# Altium schematic sheet 01_MCU.SchDoc
size A3
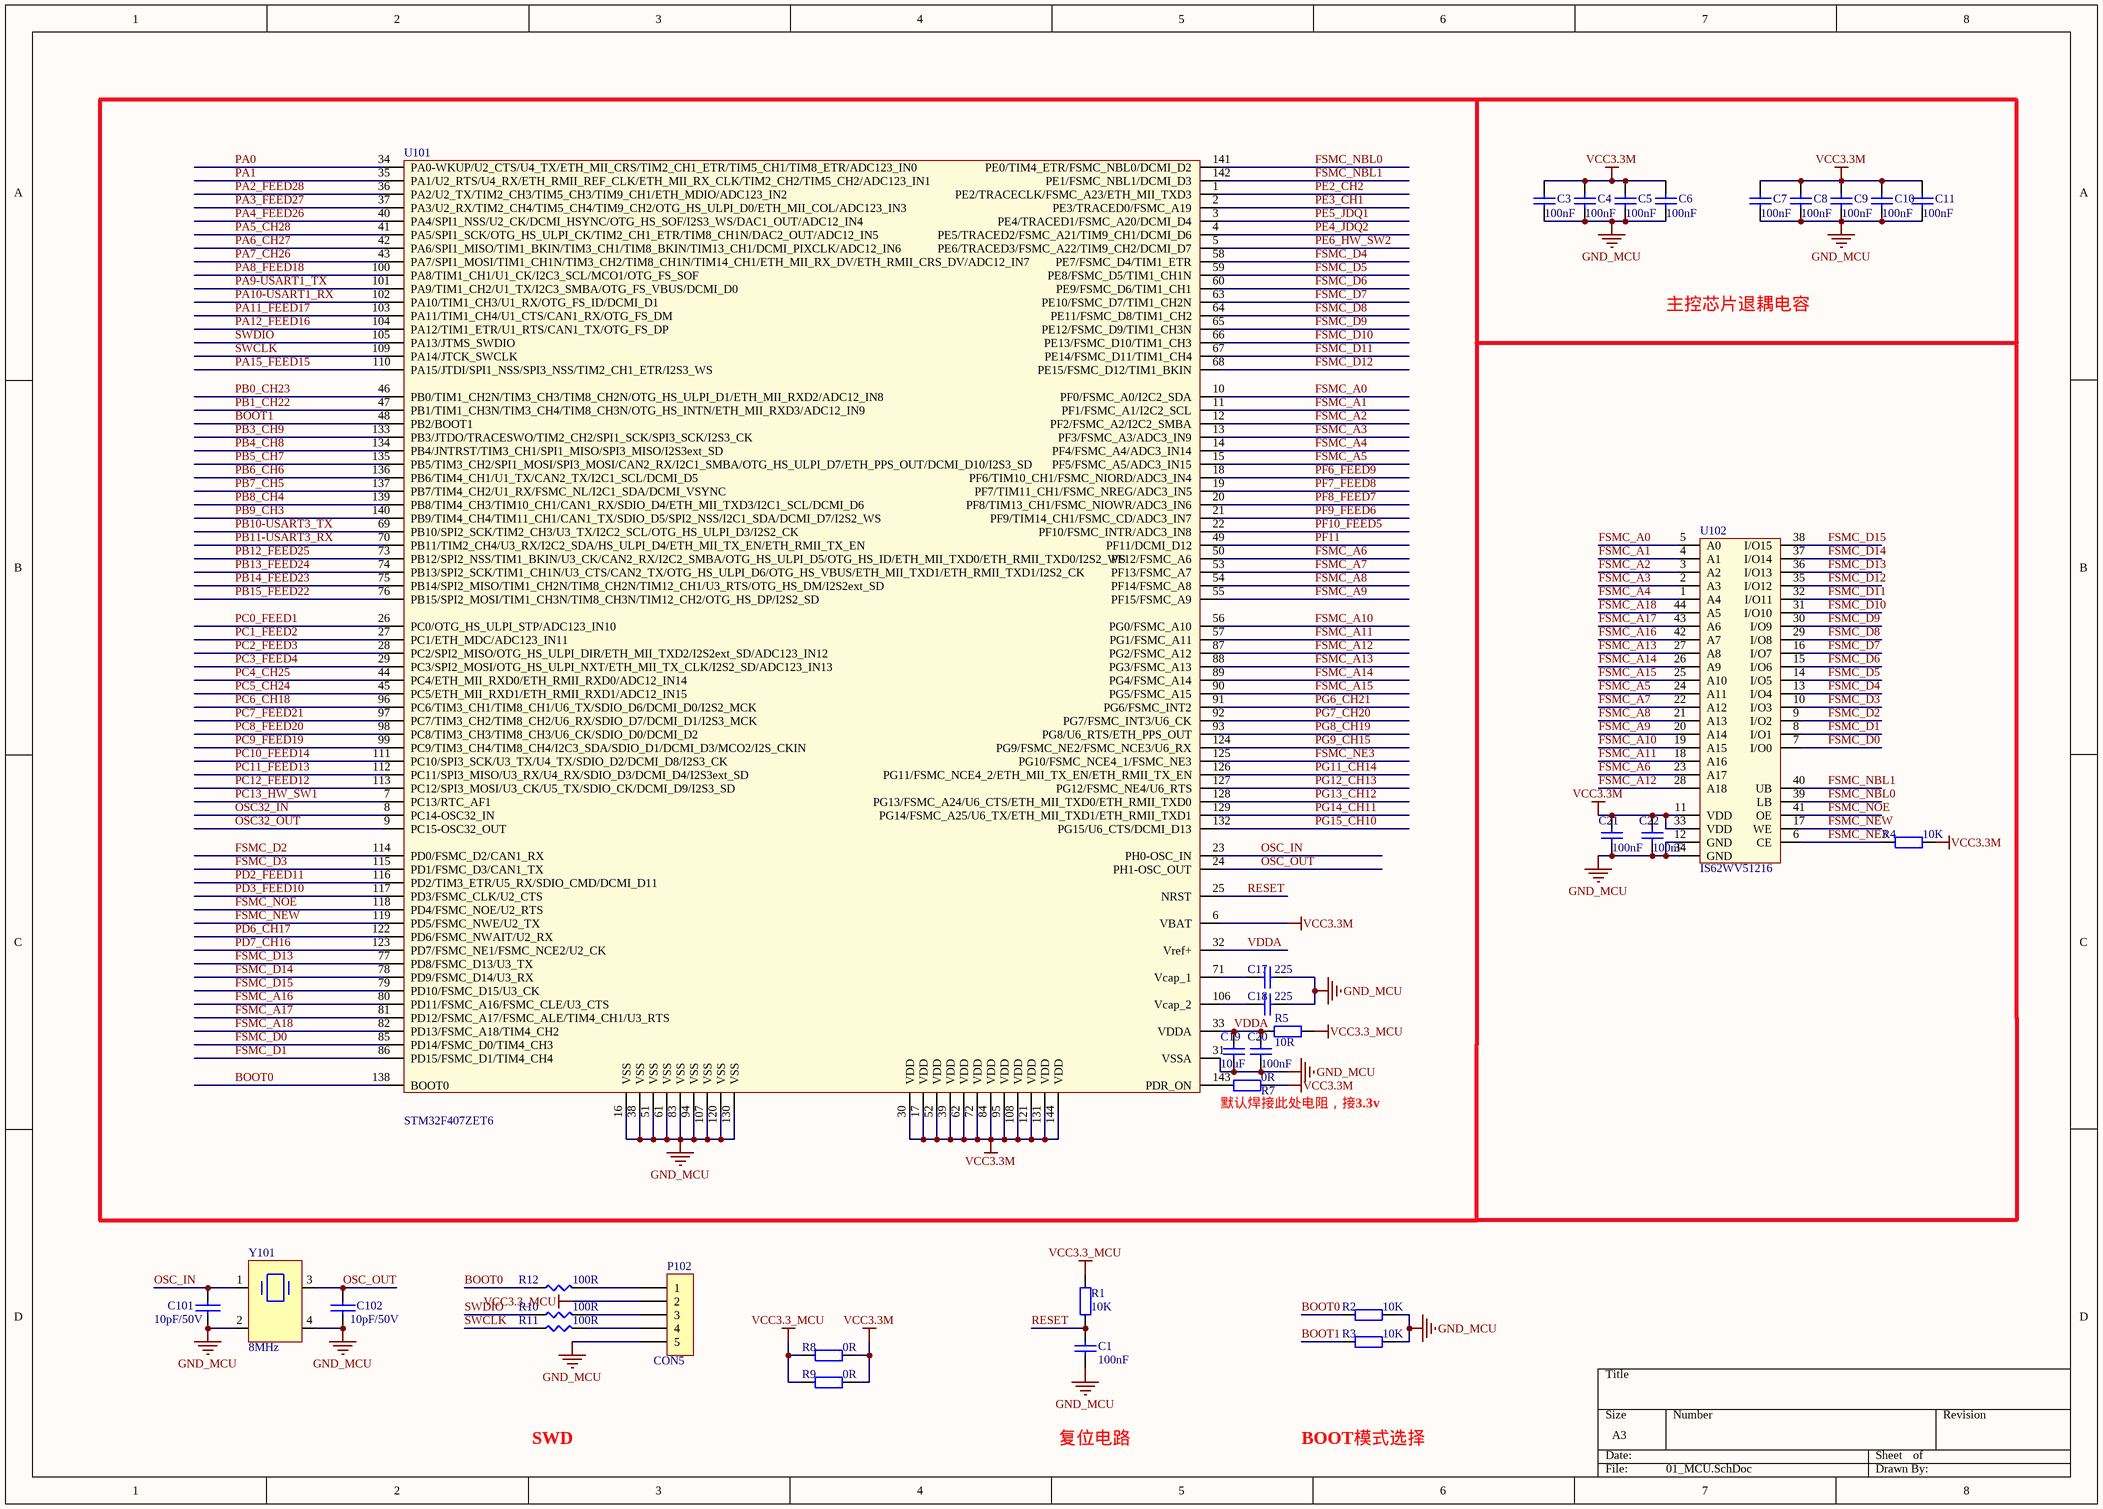
[diagram p0: 01_MCU.SchDoc]

## Parts
C1  100nF  [0603C]
C3  100nF  [0603C]
C4  100nF  [0603C]
C5  100nF  [0603C]
C6  100nF  [0603C]
C7  100nF  [0603C]
C8  100nF  [0603C]
C9  100nF  [0603C]
C10  100nF  [0603C]
C11  100nF  [0603C]
C17  225  [0603C]
C18  225  [0603C]
C19  10uF  [0603C]
C20  100nF  [0603C]
C21  100nF  [LC-0603_R]
C22  100nF  [LC-0603_R]
C101  10pF/50V  [0603C]
C102  10pF/50V  [0603C]
P102  CON5  [SIP5]
R1  10K  [0603R]
R2  10K  [0603R]
R3  10K  [0603R]
R4  10K  [0603R]
R5  10R  [0603R]
R7  0R  [0603R]
R8  0R  [0805R]
R9  0R  [0805R]
R10  100R  [0603R]
R11  100R  [0603R]
R12  100R  [0603R]
U101  STM32F407ZET6  [TQFP144]
U102  IS62WV51216  [TSOP44]
Y101  8MHz  [X_TXCWY]

## Nets
GND_MCU: C1.1 C3.2 C4.2 C5.2 C6.2 C7.2 C8.2 C9.2 C10.2 C11.2 C17.1 C18.1 C19.2 C20.2 C21.2 C22.2 C101.1 C102.1 P102.5 R2.2 R3.2 U101.16(VSS) U101.31(VSSA) U101.38(VSS) U101.51(VSS) U101.61(VSS) U101.83(VSS) U101.94(VSS) U101.107(VSS) U101.120(VSS) U101.130(VSS) U102.12(GND) U102.34(GND) Y101.2 Y101.4
VCC3.3_MCU: P102.2 R1.2 R5.2 R8.1 R9.1
VCC3.3M: C3.1 C4.1 C5.1 C6.1 C7.1 C8.1 C9.1 C10.1 C11.1 C21.1 C22.1 R4.2 R7.2 R8.2 R9.2 U101.6(VBAT) U101.17(VDD) U101.30(VDD) U101.39(VDD) U101.52(VDD) U101.62(VDD) U101.72(VDD) U101.84(VDD) U101.95(VDD) U101.108(VDD) U101.121(VDD) U101.131(VDD) U101.144(VDD) U102.11(VDD) U102.33(VDD)
BOOT0: R2.1 R12.1 U101.138(BOOT0)
BOOT1: R3.1 U101.48(PB2/BOOT1)
FSMC_A0: U101.10(PF0/FSMC_A0/I2C2_SDA) U102.5(A0)
FSMC_A1: U101.11(PF1/FSMC_A1/I2C2_SCL) U102.4(A1)
FSMC_A2: U101.12(PF2/FSMC_A2/I2C2_SMBA) U102.3(A2)
FSMC_A3: U101.13(PF3/FSMC_A3/ADC3_IN9) U102.2(A3)
FSMC_A4: U101.14(PF4/FSMC_A4/ADC3_IN14) U102.1(A4)
FSMC_A5: U101.15(PF5/FSMC_A5/ADC3_IN15) U102.24(A11)
FSMC_A6: U101.50(PF12/FSMC_A6) U102.23(A17)
FSMC_A7: U101.53(PF13/FSMC_A7) U102.22(A12)
FSMC_A8: U101.54(PF14/FSMC_A8) U102.21(A13)
FSMC_A9: U101.55(PF15/FSMC_A9) U102.20(A14)
FSMC_A10: U101.56(PG0/FSMC_A10) U102.19(A15)
FSMC_A11: U101.57(PG1/FSMC_A11) U102.18(A16)
FSMC_A12: U101.87(PG2/FSMC_A12) U102.28(A18)
FSMC_A13: U101.88(PG3/FSMC_A13) U102.27(A8)
FSMC_A14: U101.89(PG4/FSMC_A14) U102.26(A9)
FSMC_A15: U101.90(PG5/FSMC_A15) U102.25(A10)
FSMC_A16: U101.80(PD11/FSMC_A16/FSMC_CLE/U3_CTS) U102.42(A7)
FSMC_A17: U101.81(PD12/FSMC_A17/FSMC_ALE/TIM4_CH1/U3_RTS) U102.43(A6)
FSMC_A18: U101.82(PD13/FSMC_A18/TIM4_CH2) U102.44(A5)
FSMC_D0: U101.85(PD14/FSMC_D0/TIM4_CH3) U102.7(I/O0)
FSMC_D1: U101.86(PD15/FSMC_D1/TIM4_CH4) U102.8(I/O1)
FSMC_D2: U101.114(PD0/FSMC_D2/CAN1_RX) U102.9(I/O2)
FSMC_D3: U101.115(PD1/FSMC_D3/CAN1_TX) U102.10(I/O3)
FSMC_D4: U101.58(PE7/FSMC_D4/TIM1_ETR) U102.13(I/O4)
FSMC_D5: U101.59(PE8/FSMC_D5/TIM1_CH1N) U102.14(I/O5)
FSMC_D6: U101.60(PE9/FSMC_D6/TIM1_CH1) U102.15(I/O6)
FSMC_D7: U101.63(PE10/FSMC_D7/TIM1_CH2N) U102.16(I/O7)
FSMC_D8: U101.64(PE11/FSMC_D8/TIM1_CH2) U102.29(I/O8)
FSMC_D9: U101.65(PE12/FSMC_D9/TIM1_CH3N) U102.30(I/O9)
FSMC_D10: U101.66(PE13/FSMC_D10/TIM1_CH3) U102.31(I/O10)
FSMC_D11: U101.67(PE14/FSMC_D11/TIM1_CH4) U102.32(I/O11)
FSMC_D12: U101.68(PE15/FSMC_D12/TIM1_BKIN) U102.35(I/O12)
FSMC_D13: U101.77(PD8/FSMC_D13/U3_TX) U102.36(I/O13)
FSMC_D14: U101.78(PD9/FSMC_D14/U3_RX) U102.37(I/O14)
FSMC_D15: U101.79(PD10/FSMC_D15/U3_CK) U102.38(I/O15)
FSMC_NBL0: U101.141(PE0/TIM4_ETR/FSMC_NBL0/DCMI_D2) U102.39(LB)
FSMC_NBL1: U101.142(PE1/FSMC_NBL1/DCMI_D3) U102.40(UB)
FSMC_NE3: R4.1 U101.125(PG10/FSMC_NCE4_1/FSMC_NE3) U102.6(CE)
FSMC_NEW: U101.119(PD5/FSMC_NWE/U2_TX) U102.17(WE)
FSMC_NOE: U101.118(PD4/FSMC_NOE/U2_RTS) U102.41(OE)
OSC32_IN: U101.8(PC14-OSC32_IN)
OSC32_OUT: U101.9(PC15-OSC32_OUT)
OSC_IN: C101.2 U101.23(PH0-OSC_IN) Y101.1
OSC_OUT: C102.2 U101.24(PH1-OSC_OUT) Y101.3
PA0: U101.34(PA0-WKUP/U2_CTS/U4_TX/ETH_MII_CRS/TIM2_CH1_ETR/TIM5_CH1/TIM8_ETR/ADC123_IN0)
PA1: U101.35(PA1/U2_RTS/U4_RX/ETH_RMII_REF_CLK/ETH_MII_RX_CLK/TIM2_CH2/TIM5_CH2/ADC123_IN1)
PA2_FEED28: U101.36(PA2/U2_TX/TIM2_CH3/TIM5_CH3/TIM9_CH1/ETH_MDIO/ADC123_IN2)
PA3_FEED27: U101.37(PA3/U2_RX/TIM2_CH4/TIM5_CH4/TIM9_CH2/OTG_HS_ULPI_D0/ETH_MII_COL/ADC123_IN3)
PA4_FEED26: U101.40(PA4/SPI1_NSS/U2_CK/DCMI_HSYNC/OTG_HS_SOF/I2S3_WS/DAC1_OUT/ADC12_IN4)
PA5_CH28: U101.41(PA5/SPI1_SCK/OTG_HS_ULPI_CK/TIM2_CH1_ETR/TIM8_CH1N/DAC2_OUT/ADC12_IN5)
PA6_CH27: U101.42(PA6/SPI1_MISO/TIM1_BKIN/TIM3_CH1/TIM8_BKIN/TIM13_CH1/DCMI_PIXCLK/ADC12_IN6)
PA7_CH26: U101.43(PA7/SPI1_MOSI/TIM1_CH1N/TIM3_CH2/TIM8_CH1N/TIM14_CH1/ETH_MII_RX_DV/ETH_RMII_CRS_DV/ADC12_IN7)
PA8_FEED18: U101.100(PA8/TIM1_CH1/U1_CK/I2C3_SCL/MCO1/OTG_FS_SOF)
PA9-USART1_TX: U101.101(PA9/TIM1_CH2/U1_TX/I2C3_SMBA/OTG_FS_VBUS/DCMI_D0)
PA10-USART1_RX: U101.102(PA10/TIM1_CH3/U1_RX/OTG_FS_ID/DCMI_D1)
PA11_FEED17: U101.103(PA11/TIM1_CH4/U1_CTS/CAN1_RX/OTG_FS_DM)
PA12_FEED16: U101.104(PA12/TIM1_ETR/U1_RTS/CAN1_TX/OTG_FS_DP)
PA15_FEED15: U101.110(PA15/JTDI/SPI1_NSS/SPI3_NSS/TIM2_CH1_ETR/I2S3_WS)
PB0_CH23: U101.46(PB0/TIM1_CH2N/TIM3_CH3/TIM8_CH2N/OTG_HS_ULPI_D1/ETH_MII_RXD2/ADC12_IN8)
PB1_CH22: U101.47(PB1/TIM1_CH3N/TIM3_CH4/TIM8_CH3N/OTG_HS_INTN/ETH_MII_RXD3/ADC12_IN9)
PB3_CH9: U101.133(PB3/JTDO/TRACESWO/TIM2_CH2/SPI1_SCK/SPI3_SCK/I2S3_CK)
PB4_CH8: U101.134(PB4/JNTRST/TIM3_CH1/SPI1_MISO/SPI3_MISO/I2S3ext_SD)
PB5_CH7: U101.135(PB5/TIM3_CH2/SPI1_MOSI/SPI3_MOSI/CAN2_RX/I2C1_SMBA/OTG_HS_ULPI_D7/ETH_PPS_OUT/DCMI_D10/I2S3_SD)
PB6_CH6: U101.136(PB6/TIM4_CH1/U1_TX/CAN2_TX/I2C1_SCL/DCMI_D5)
PB7_CH5: U101.137(PB7/TIM4_CH2/U1_RX/FSMC_NL/I2C1_SDA/DCMI_VSYNC)
PB8_CH4: U101.139(PB8/TIM4_CH3/TIM10_CH1/CAN1_RX/SDIO_D4/ETH_MII_TXD3/I2C1_SCL/DCMI_D6)
PB9_CH3: U101.140(PB9/TIM4_CH4/TIM11_CH1/CAN1_TX/SDIO_D5/SPI2_NSS/I2C1_SDA/DCMI_D7/I2S2_WS)
PB10-USART3_TX: U101.69(PB10/SPI2_SCK/TIM2_CH3/U3_TX/I2C2_SCL/OTG_HS_ULPI_D3/I2S2_CK)
PB11-USART3_RX: U101.70(PB11/TIM2_CH4/U3_RX/I2C2_SDA/HS_ULPI_D4/ETH_MII_TX_EN/ETH_RMII_TX_EN)
PB12_FEED25: U101.73(PB12/SPI2_NSS/TIM1_BKIN/U3_CK/CAN2_RX/I2C2_SMBA/OTG_HS_ULPI_D5/OTG_HS_ID/ETH_MII_TXD0/ETH_RMII_TXD0/I2S2_WS)
PB13_FEED24: U101.74(PB13/SPI2_SCK/TIM1_CH1N/U3_CTS/CAN2_TX/OTG_HS_ULPI_D6/OTG_HS_VBUS/ETH_MII_TXD1/ETH_RMII_TXD1/I2S2_CK)
PB14_FEED23: U101.75(PB14/SPI2_MISO/TIM1_CH2N/TIM8_CH2N/TIM12_CH1/U3_RTS/OTG_HS_DM/I2S2ext_SD)
PB15_FEED22: U101.76(PB15/SPI2_MOSI/TIM1_CH3N/TIM8_CH3N/TIM12_CH2/OTG_HS_DP/I2S2_SD)
PC0_FEED1: U101.26(PC0/OTG_HS_ULPI_STP/ADC123_IN10)
PC1_FEED2: U101.27(PC1/ETH_MDC/ADC123_IN11)
PC2_FEED3: U101.28(PC2/SPI2_MISO/OTG_HS_ULPI_DIR/ETH_MII_TXD2/I2S2ext_SD/ADC123_IN12)
PC3_FEED4: U101.29(PC3/SPI2_MOSI/OTG_HS_ULPI_NXT/ETH_MII_TX_CLK/I2S2_SD/ADC123_IN13)
PC4_CH25: U101.44(PC4/ETH_MII_RXD0/ETH_RMII_RXD0/ADC12_IN14)
PC5_CH24: U101.45(PC5/ETH_MII_RXD1/ETH_RMII_RXD1/ADC12_IN15)
PC6_CH18: U101.96(PC6/TIM3_CH1/TIM8_CH1/U6_TX/SDIO_D6/DCMI_D0/I2S2_MCK)
PC7_FEED21: U101.97(PC7/TIM3_CH2/TIM8_CH2/U6_RX/SDIO_D7/DCMI_D1/I2S3_MCK)
PC8_FEED20: U101.98(PC8/TIM3_CH3/TIM8_CH3/U6_CK/SDIO_D0/DCMI_D2)
PC9_FEED19: U101.99(PC9/TIM3_CH4/TIM8_CH4/I2C3_SDA/SDIO_D1/DCMI_D3/MCO2/I2S_CKIN)
PC10_FEED14: U101.111(PC10/SPI3_SCK/U3_TX/U4_TX/SDIO_D2/DCMI_D8/I2S3_CK)
PC11_FEED13: U101.112(PC11/SPI3_MISO/U3_RX/U4_RX/SDIO_D3/DCMI_D4/I2S3ext_SD)
PC12_FEED12: U101.113(PC12/SPI3_MOSI/U3_CK/U5_TX/SDIO_CK/DCMI_D9/I2S3_SD)
PC13_HW_SW1: U101.7(PC13/RTC_AF1)
PD2_FEED11: U101.116(PD2/TIM3_ETR/U5_RX/SDIO_CMD/DCMI_D11)
PD3_FEED10: U101.117(PD3/FSMC_CLK/U2_CTS)
PD6_CH17: U101.122(PD6/FSMC_NWAIT/U2_RX)
PD7_CH16: U101.123(PD7/FSMC_NE1/FSMC_NCE2/U2_CK)
PE2_CH2: U101.1(PE2/TRACECLK/FSMC_A23/ETH_MII_TXD3)
PE3_CH1: U101.2(PE3/TRACED0/FSMC_A19)
PE4_JDQ2: U101.4(PE5/TRACED2/FSMC_A21/TIM9_CH1/DCMI_D6)
PE5_JDQ1: U101.3(PE4/TRACED1/FSMC_A20/DCMI_D4)
PE6_HW_SW2: U101.5(PE6/TRACED3/FSMC_A22/TIM9_CH2/DCMI_D7)
PF6_FEED9: U101.18(PF6/TIM10_CH1/FSMC_NIORD/ADC3_IN4)
PF7_FEED8: U101.19(PF7/TIM11_CH1/FSMC_NREG/ADC3_IN5)
PF8_FEED7: U101.20(PF8/TIM13_CH1/FSMC_NIOWR/ADC3_IN6)
PF9_FEED6: U101.21(PF9/TIM14_CH1/FSMC_CD/ADC3_IN7)
PF10_FEED5: U101.22(PF10/FSMC_INTR/ADC3_IN8)
PF11: U101.49(PF11/DCMI_D12)
PG6_CH21: U101.91(PG6/FSMC_INT2)
PG7_CH20: U101.92(PG7/FSMC_INT3/U6_CK)
PG8_CH19: U101.93(PG8/U6_RTS/ETH_PPS_OUT)
PG9_CH15: U101.124(PG9/FSMC_NE2/FSMC_NCE3/U6_RX)
PG11_CH14: U101.126(PG11/FSMC_NCE4_2/ETH_MII_TX_EN/ETH_RMII_TX_EN)
PG12_CH13: U101.127(PG12/FSMC_NE4/U6_RTS)
PG13_CH12: U101.128(PG13/FSMC_A24/U6_CTS/ETH_MII_TXD0/ETH_RMII_TXD0)
PG14_CH11: U101.129(PG14/FSMC_A25/U6_TX/ETH_MII_TXD1/ETH_RMII_TXD1)
PG15_CH10: U101.132(PG15/U6_CTS/DCMI_D13)
RESET: C1.2 R1.1 U101.25(NRST)
SWCLK: R11.1 U101.109(PA14/JTCK_SWCLK)
SWDIO: R10.1 U101.105(PA13/JTMS_SWDIO)
VDDA: C19.1 C20.1 R5.1 U101.32(Vref+) U101.33(VDDA)
NetC17_2: C17.2 U101.71(Vcap_1)
NetC18_2: C18.2 U101.106(Vcap_2)
NetP102_1: P102.1 R12.2
NetP102_3: P102.3 R10.2
NetP102_4: P102.4 R11.2
NetR7_1: R7.1 U101.143(PDR_ON)

## Notes on the sheet
- 主控芯片退耦电容
- 默认焊接此处电阻，接3.3v
- SWD
- 复位电路
- BOOT模式选择

## Library data of the parts
C1 C3-C11 C17-C22 = Cap: 无极性电容; Published: 8-Jun-2000; LatestRevisionDate: 17-Jul-2002; LatestRevisionNote: Re-released for DXP Platform.; PackageReference: RAD-0.3; Publisher: Altium Limited
C101 C102 = CAP: Capacitor
P102 = CON5: Connector
R1-R5 R7-R9 = 0603 2.7KΩ (2701) 1%: 贴片电阻; ComponentLink1Description: 供应商链接; ComponentLink1URL: http://www.szlcsc.com/product/details_13814.html; Package: 0603; Supplier: LC; SuppliersPartNumber: C13167
R10-R12 = 0603R
Y101 = SMD3225